# Altium schematic sheet COMMUNICATION.SchDoc
size 420 x 297 mm; SheetNumber: 3; SheetTotal: 4
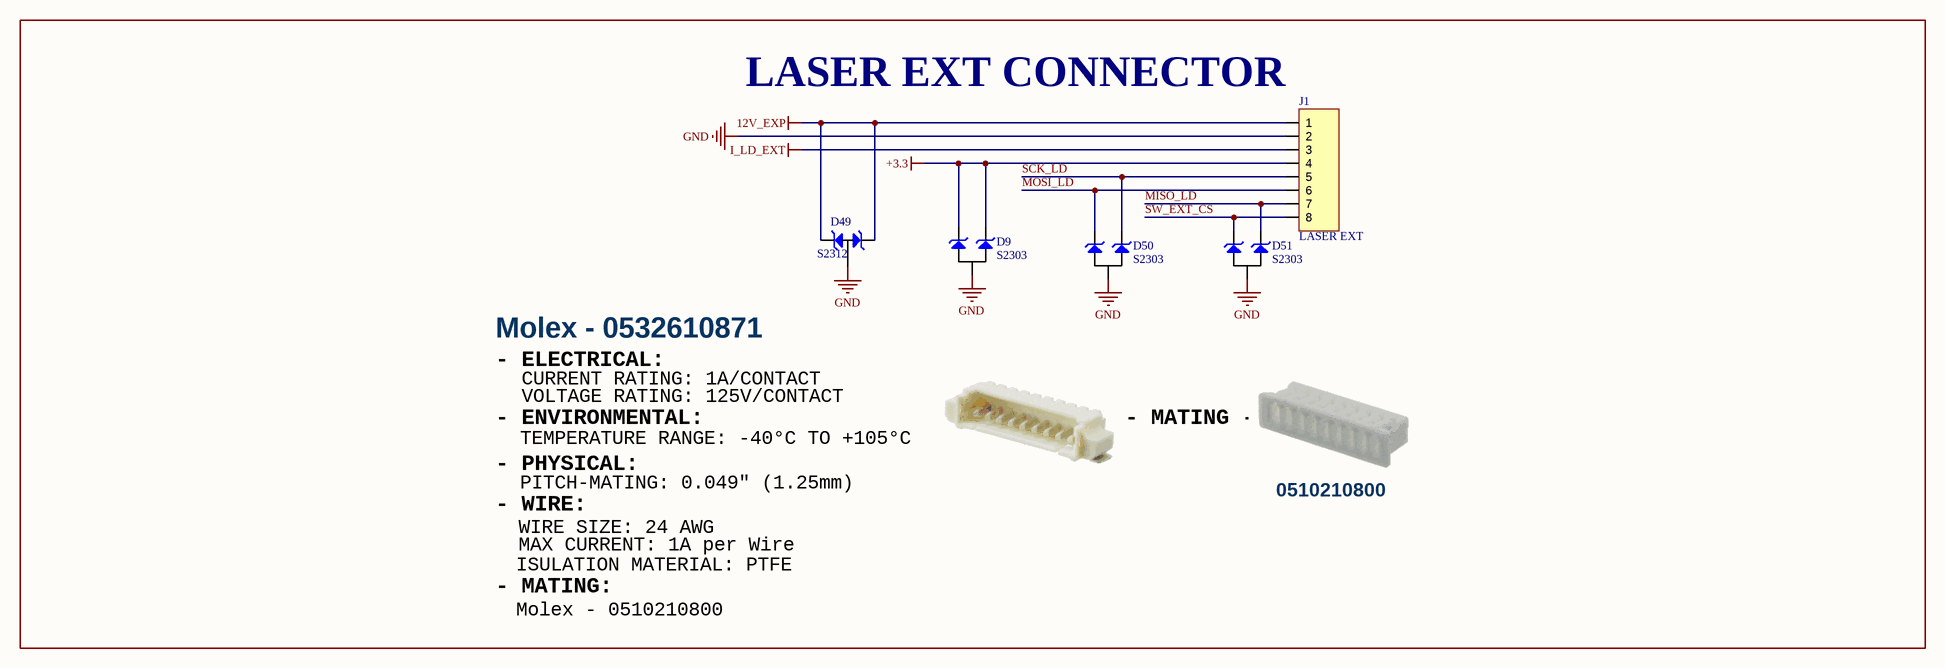
[diagram p0: COMMUNICATION.SchDoc]

## Parts
D9  S2303  [SOT23-123]
D49  S2312  [SOT23-123]
D50  S2303  [SOT23-123]
D51  S2303  [SOT23-123]
J1  LASER EXT  [0532610871]

## Nets
12V_EXP: D49.1 D49.3 J1.1
+3.3: D9.1 D9.3 J1.4
GND: D9.2 D49.2 D50.2 D51.2 J1.2
I_LD_EXT: J1.3
MISO_LD: D51.3 J1.7
MOSI_LD: D50.1 J1.6
SCK_LD: D50.3 J1.5
SW_EXT_CS: D51.1 J1.8

## Notes on the sheet
- LASER EXT CONNECTOR
- Molex - 0532610871
- - ELECTRICAL:
- CURRENT RATING: 1A/CONTACT
- VOLTAGE RATING: 125V/CONTACT
- - ENVIRONMENTAL:
- - PHYSICAL:
- TEMPERATURE RANGE: -40°C TO +105°C
- - MATING -
- - WIRE:
- WIRE SIZE: 24 AWG
- PITCH-MATING: 0.049" (1.25mm)
- 0510210800
- - MATING:
- ISULATION MATERIAL: PTFE
- MAX CURRENT: 1A per Wire
- Molex - 0510210800
- Project:
- BEE-PC1
- Sub-system:
- Design by:
- Hung Nguyen D.
- Bao Bui Q.
- Sheet title:
- Sheet
- A3
- of
- Checked by:
- Approved by:
- Vu Pham
- Revision:
- Document No:
- V1.2.0
- Size:
- Date:

## Library data of the parts
D9 D50 D51 = S2303: TVS DIODE 3.3VWM 8VC SOT23, P/N: / S2303
D49 = S2315: TVS DIODE 12VWM 19VC SOT23, P/N:  S2312
J1 = JP8: WR-PHD 2.54 mm Angled Socket Header; Manufacturer: W¨¹rth Elektronik eiSos GmbH; partNo: 613008143121; ComponentLink1 Description: Manufacturer; ComponentLink2 Description: Datasheet; NoPins: 08; Created Date: 29 March 2013; ComponentLink1URL: http://www.we-online.com; ComponentLink2URL: http://katalog.we-online.de/em/datasheet/6130xx143121.pdf; Created by: Karrer Zheng